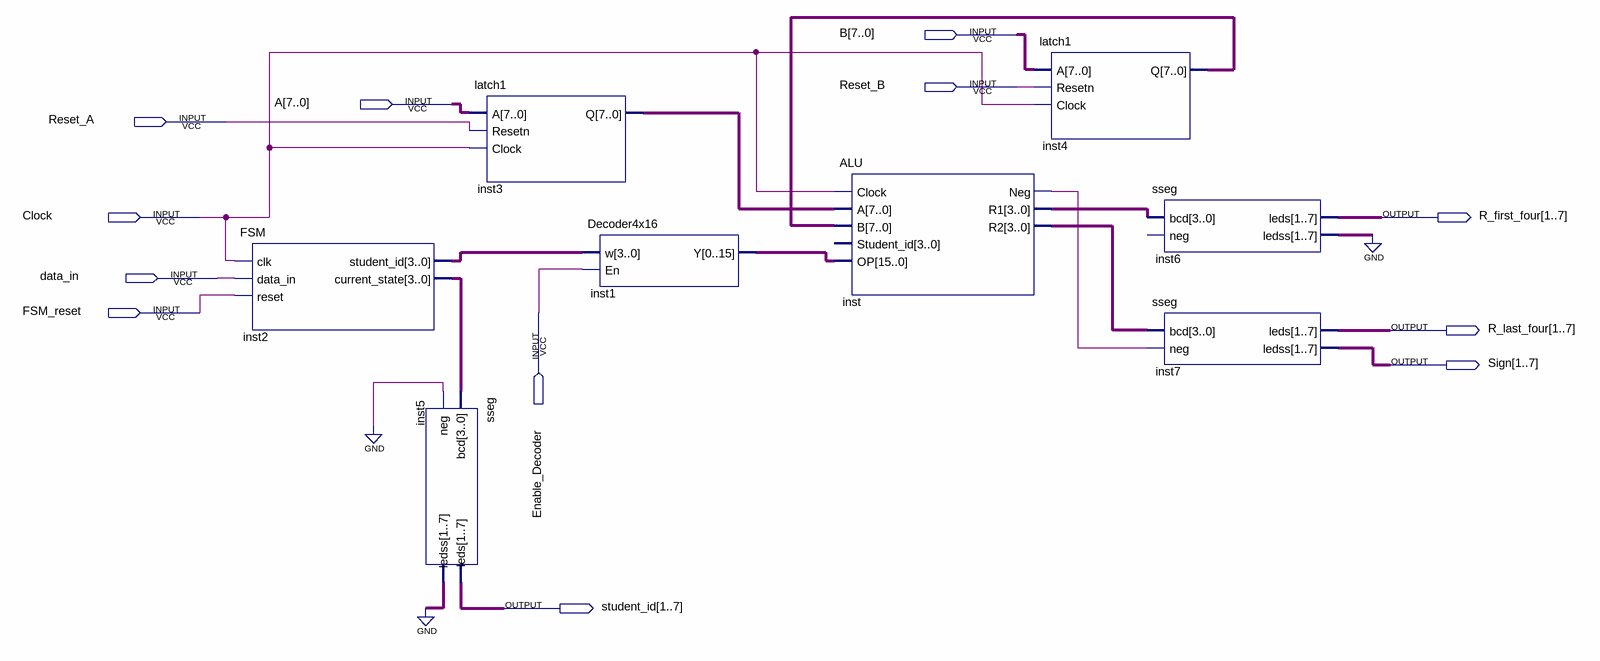
[diagram p0: schematic sheet]
// Quartus schematic Lab6.bdf as structural Verilog: 8 symbols, 12 pins
module Lab6 (
  input  [7:0] B,
  input  Reset_B,
  input  [7:0] A,
  input  Reset_A,
  input  Clock,
  input  data_in,
  input  FSM_reset,
  input  Enable_Decoder,
  output [1:7] R_first_four,
  output [1:7] R_last_four,
  output [1:7] Sign,
  output [1:7] student_id
);

  wire inst_neg;
  wire [3:0] inst2_current_state, inst2_student_id, inst_r1, inst_r2;
  wire [6:0] inst5_ledss, inst6_ledss;
  wire [7:0] inst3_q, inst4_q;
  wire [15:0] inst1_y;

  FSM inst2 (
    .clk(Clock), .data_in(data_in), .reset(FSM_reset), .student_id(inst2_student_id),
    .current_state(inst2_current_state));
  sseg inst5 (.bcd(inst2_current_state), .neg(1'b0), .leds(student_id), .ledss(inst5_ledss));
  latch1 inst3 (.A(A), .Resetn(Reset_A), .Clock(Clock), .Q(inst3_q));
  Decoder4x16 inst1 (.w(inst2_student_id), .En(Enable_Decoder), .Y(inst1_y));
  ALU inst (
    .Clock(Clock), .A(inst3_q), .B(inst4_q), .OP(inst1_y), .Neg(inst_neg), .R1(inst_r1), .R2(inst_r2));  // open: Student_id
  latch1 inst4 (.A(B), .Resetn(Reset_B), .Clock(Clock), .Q(inst4_q));
  sseg inst6 (.bcd(inst_r1), .leds(R_first_four), .ledss(inst6_ledss));  // open: neg
  sseg inst7 (.bcd(inst_r2), .neg(inst_neg), .leds(R_last_four), .ledss(Sign));
  // also tied to GND on the sheet: {inst5_ledss[0], inst5_ledss[1], inst5_ledss[2], inst5_ledss[3], inst5_ledss[4], inst5_ledss[5], inst5_ledss[6], inst6_ledss[0], inst6_ledss[1], inst6_ledss[2], inst6_ledss[3], inst6_ledss[4], inst6_ledss[5], inst6_ledss[6]}
endmodule
